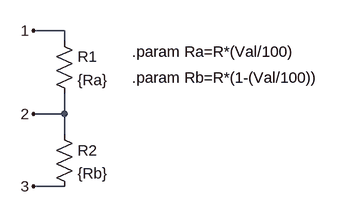
[diagram p0: schematic pot.asc]
pot.asc, the LTspice schematic file:
Version 4
SHEET 1 880 680
WIRE 144 48 96 48
WIRE 144 64 144 48
WIRE 144 176 144 144
WIRE 144 176 96 176
WIRE 144 208 144 176
WIRE 144 288 96 288
FLAG 96 48 1
FLAG 96 176 2
FLAG 96 288 3
SYMBOL res 128 48 R0
SYMATTR InstName R1
SYMATTR Value {Ra}
SYMBOL res 128 192 R0
SYMATTR InstName R2
SYMATTR Value {Rb}
TEXT 248 80 Left 2 !.param Ra=R*(Val/100)
TEXT 248 120 Left 2 !.param Rb=R*(1-(Val/100))

The netlist it stands for:
* pot.asc
R1 1 2 {Ra}
R2 2 3 {Rb}
.param Ra=R*(Val/100)
.param Rb=R*(1-(Val/100))
.backanno
.end